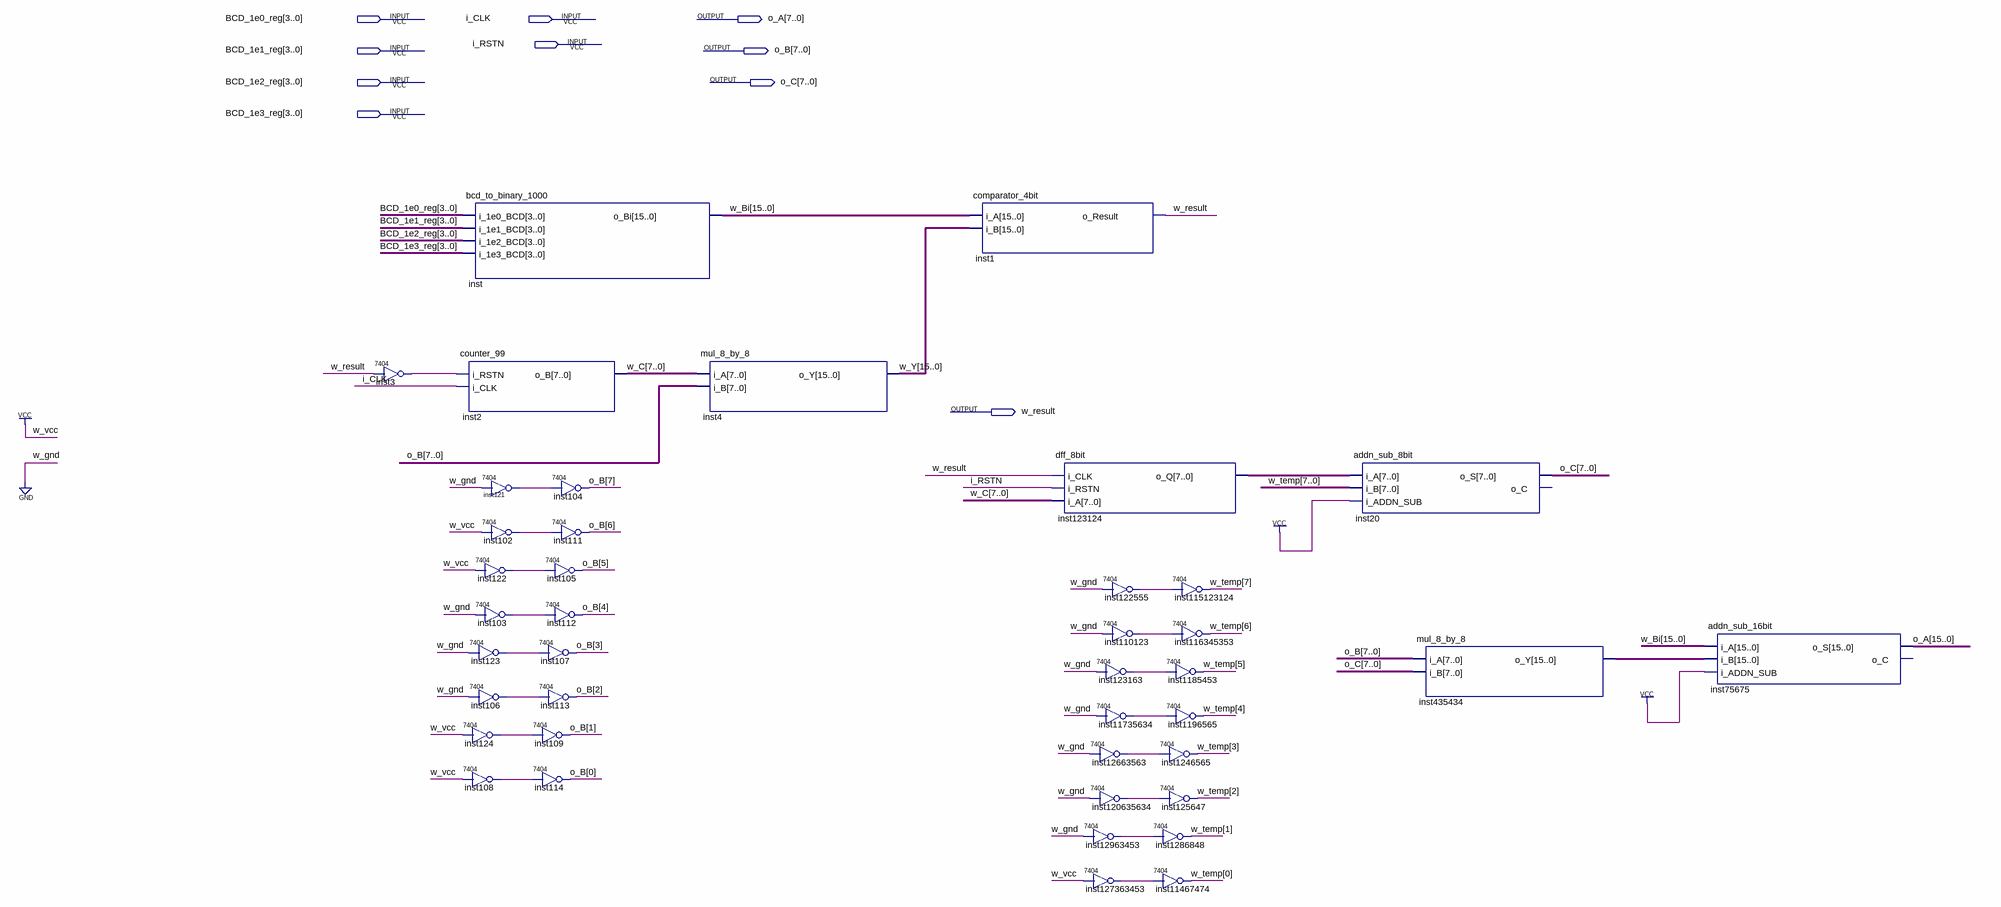
[diagram p0: schematic sheet]
// Quartus schematic decipher.bdf as structural Verilog: 41 symbols, 10 pins
module decipher (
  input  [3:0] BCD_1e0_reg,
  input  i_CLK,
  input  i_RSTN,
  input  [3:0] BCD_1e1_reg,
  input  [3:0] BCD_1e2_reg,
  input  [3:0] BCD_1e3_reg,
  output [15:0] o_A,
  output [7:0] o_B,
  output [7:0] o_C,
  output w_result
);

  wire inst3_1, inst102_1, inst103_1, inst106_1, inst108_1, inst121_1, inst122_1, inst123_1, inst124_1,
       inst110123_1, inst122555_1, inst123163_1, inst11735634_1, inst12663563_1, inst12963453_1,
       inst120635634_1, inst127363453_1;
  wire [7:0] inst123124_o_q, w_C, w_temp;
  wire [15:0] inst435434_o_y, w_Bi, w_Y;

  \7404  inst3 (.\2 (w_result), .\1 (inst3_1));
  bcd_to_binary_1000 inst (
    .i_1e0_BCD(BCD_1e0_reg), .i_1e1_BCD(BCD_1e1_reg), .i_1e2_BCD(BCD_1e2_reg), .i_1e3_BCD(BCD_1e3_reg),
    .o_Bi(w_Bi));
  counter_99 inst2 (.i_RSTN(inst3_1), .i_CLK(i_CLK), .o_B(w_C));
  \7404  inst121 (.\2 (1'b0), .\1 (inst121_1));
  \7404  inst102 (.\2 (1'b1), .\1 (inst102_1));
  \7404  inst122 (.\2 (1'b1), .\1 (inst122_1));
  \7404  inst103 (.\2 (1'b0), .\1 (inst103_1));
  \7404  inst123 (.\2 (1'b0), .\1 (inst123_1));
  \7404  inst106 (.\2 (1'b0), .\1 (inst106_1));
  \7404  inst124 (.\2 (1'b1), .\1 (inst124_1));
  \7404  inst108 (.\2 (1'b1), .\1 (inst108_1));
  \7404  inst104 (.\2 (inst121_1), .\1 (o_B[7]));
  \7404  inst111 (.\2 (inst102_1), .\1 (o_B[6]));
  \7404  inst105 (.\2 (inst122_1), .\1 (o_B[5]));
  \7404  inst112 (.\2 (inst103_1), .\1 (o_B[4]));
  \7404  inst107 (.\2 (inst123_1), .\1 (o_B[3]));
  \7404  inst113 (.\2 (inst106_1), .\1 (o_B[2]));
  \7404  inst109 (.\2 (inst124_1), .\1 (o_B[1]));
  \7404  inst114 (.\2 (inst108_1), .\1 (o_B[0]));
  mul_8_by_8 inst4 (.i_A(w_C), .i_B(o_B), .o_Y(w_Y));
  comparator_4bit inst1 (.i_A(w_Bi), .i_B(w_Y), .o_Result(w_result));
  dff_8bit inst123124 (.i_CLK(w_result), .i_RSTN(i_RSTN), .i_A(w_C), .o_Q(inst123124_o_q));
  \7404  inst122555 (.\2 (1'b0), .\1 (inst122555_1));
  \7404  inst110123 (.\2 (1'b0), .\1 (inst110123_1));
  \7404  inst123163 (.\2 (1'b0), .\1 (inst123163_1));
  \7404  inst11735634 (.\2 (1'b0), .\1 (inst11735634_1));
  \7404  inst12663563 (.\2 (1'b0), .\1 (inst12663563_1));
  \7404  inst120635634 (.\2 (1'b0), .\1 (inst120635634_1));
  \7404  inst12963453 (.\2 (1'b0), .\1 (inst12963453_1));
  \7404  inst127363453 (.\2 (1'b1), .\1 (inst127363453_1));
  \7404  inst1246565 (.\2 (inst12663563_1), .\1 (w_temp[3]));
  \7404  inst125647 (.\2 (inst120635634_1), .\1 (w_temp[2]));
  \7404  inst1286848 (.\2 (inst12963453_1), .\1 (w_temp[1]));
  \7404  inst11467474 (.\2 (inst127363453_1), .\1 (w_temp[0]));
  \7404  inst115123124 (.\2 (inst122555_1), .\1 (w_temp[7]));
  \7404  inst116345353 (.\2 (inst110123_1), .\1 (w_temp[6]));
  \7404  inst1185453 (.\2 (inst123163_1), .\1 (w_temp[5]));
  \7404  inst1196565 (.\2 (inst11735634_1), .\1 (w_temp[4]));
  addn_sub_8bit inst20 (.i_A(inst123124_o_q), .i_B(w_temp), .i_ADDN_SUB(1'b1), .o_S(o_C));  // open: o_C
  mul_8_by_8 inst435434 (.i_A(o_B), .i_B(o_C), .o_Y(inst435434_o_y));
  addn_sub_16bit inst75675 (.i_A(w_Bi), .i_B(inst435434_o_y), .i_ADDN_SUB(1'b1), .o_S(o_A));  // open: o_C
endmodule
